# EasyEDA Pro project LuxcampBadge2025.epro, schematic LED_FLIPPED
Board Name: LED_FLIPPED; Create Date: 2025-07-09; Page Name: P1; Project Name: Luxcamp Badge 2025; Schematic Name: LED_FLIPPED; Update Date: 2025-07-09; Company: EasyEDA.com; Page Size: A4; Version: V1.0
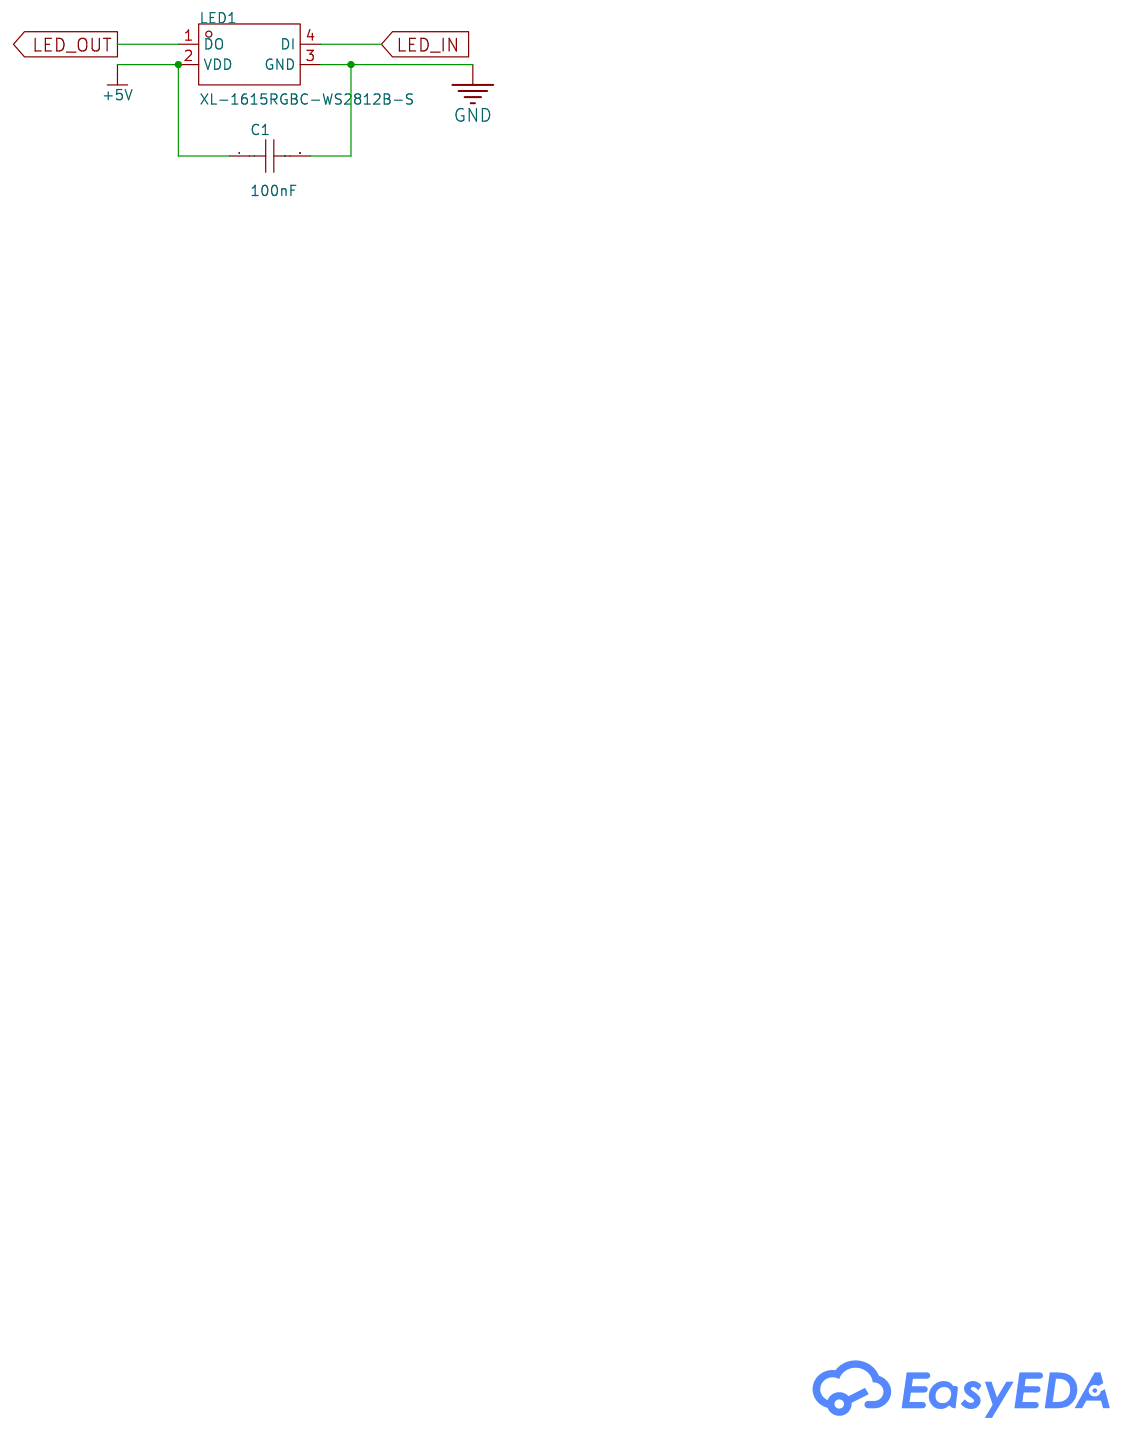
[diagram p1: schematic sheet]

## Parts
C1  100nF  [C0402]
LED1  XL-1615RGBC-WS2812B-S  [LED-SMD_4P-L1.6-W1.5_XL-1615RGBC-WS2812B-S]

## Library data of the parts
C1 = CGA0402X7R104K160GT: Capacitance:100nF Tolerance:±10% Tolerance:±10% Voltage Rated: Temperature Coefficient:; LCSC Part Name: 100nF ±10% 16V; Supplier Part: C6119799; Manufacturer: HRE(芯声); Supplier Footprint: 0402; JLCPCB Part Class: Extended Part; Supplier: LCSC; Tolerance: ±10%
LED1 = XL-1615RGBC-WS2812B-S: Wavelength:530nm；520nm；620nm~630nm Luminous Intensity:800mcd；150mcd；180mcd Quiescent Current:- Lens Color:Transparent Lens Operating Temperature:-40℃~+85℃ Peak Wavelength:525nm；475nm；625nm; Supplier Part: C41413180; Manufacturer: XINGLIGHT(成兴光); Supplier Footprint: SMD-4P,1.6x1.5mm; JLCPCB Part Class: Extended Part; Datasheet: https://atta.szlcsc.com/upload/public/pdf/source/20250225/338E99D216FC0D8D9BCFEB5A788D0960.pdf; Supplier: LCSC; Wavelength: 530nm；520nm；620nm~630nm; Luminous Intensity: 800mcd；150mcd；180mcd; Lens Color: Transparent Lens; Operating Temperature: -40℃~+85℃; Peak Wavelength: 525nm；475nm；625nm

## Nets
+5V: C1.1 LED1.2(VDD)
GND: C1.2 LED1.3(GND)
LED_IN: LED1.4(DI)
LED_OUT: LED1.1(DO)
